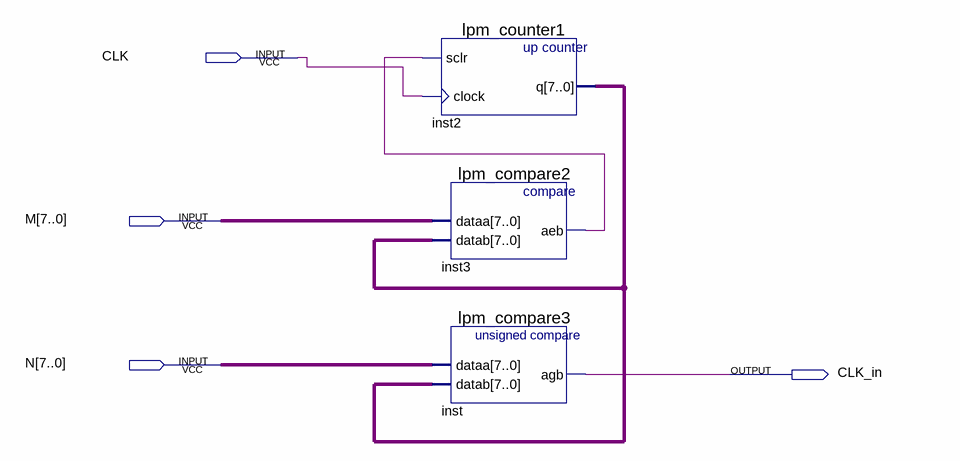
[diagram p0: schematic sheet]
// Quartus schematic Block1_0.bdf as structural Verilog: 3 symbols, 4 pins
module Block1_0 (
  input  CLK,
  input  [7:0] M,
  input  [7:0] N,
  output CLK_in
);

  wire inst3_aeb;
  wire [7:0] inst2_q;

  lpm_counter1 inst2 (.sclr(inst3_aeb), .clock(CLK), .q(inst2_q));
  lpm_compare2 inst3 (.dataa(M), .datab(inst2_q), .aeb(inst3_aeb));
  lpm_compare3 inst (.dataa(N), .datab(inst2_q), .agb(CLK_in));
endmodule
